# EAGLE board melzi (EAGLE 6.2)
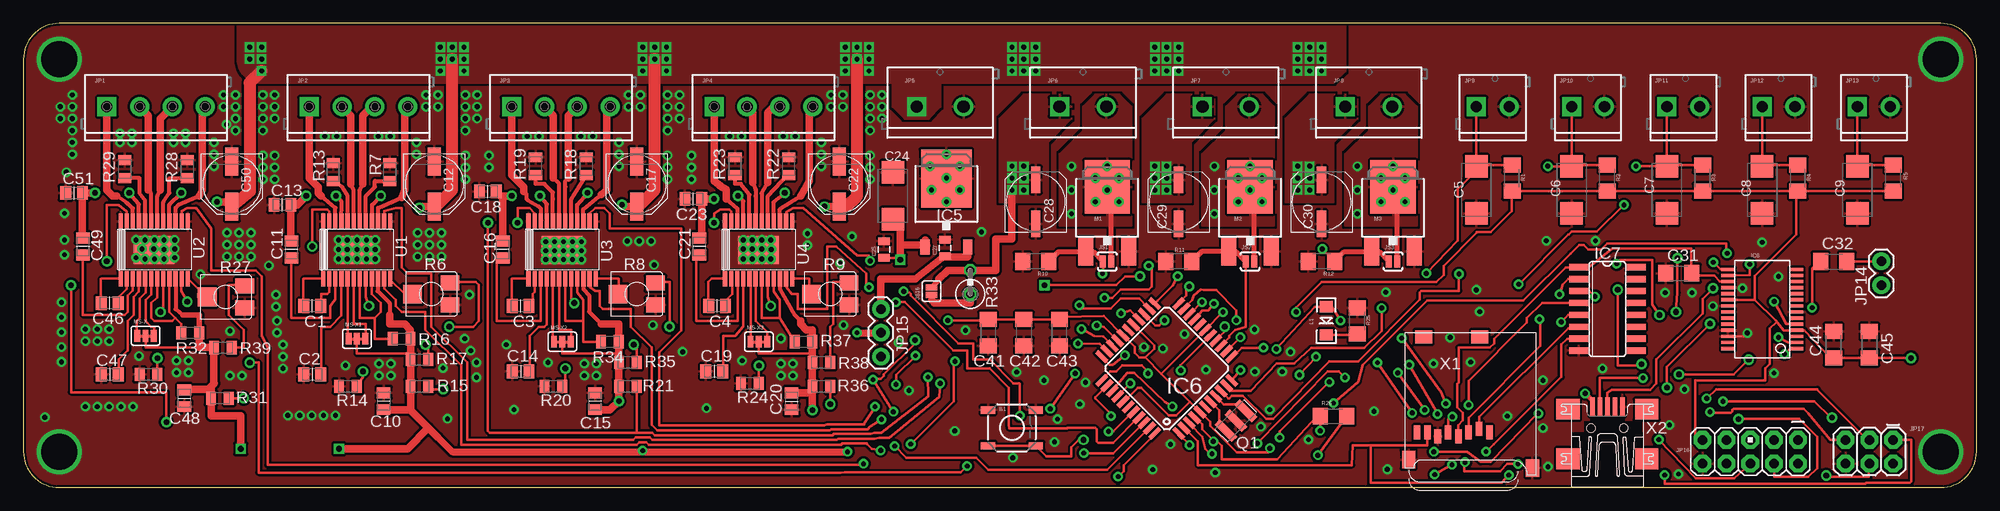
[diagram p2: board, top side]
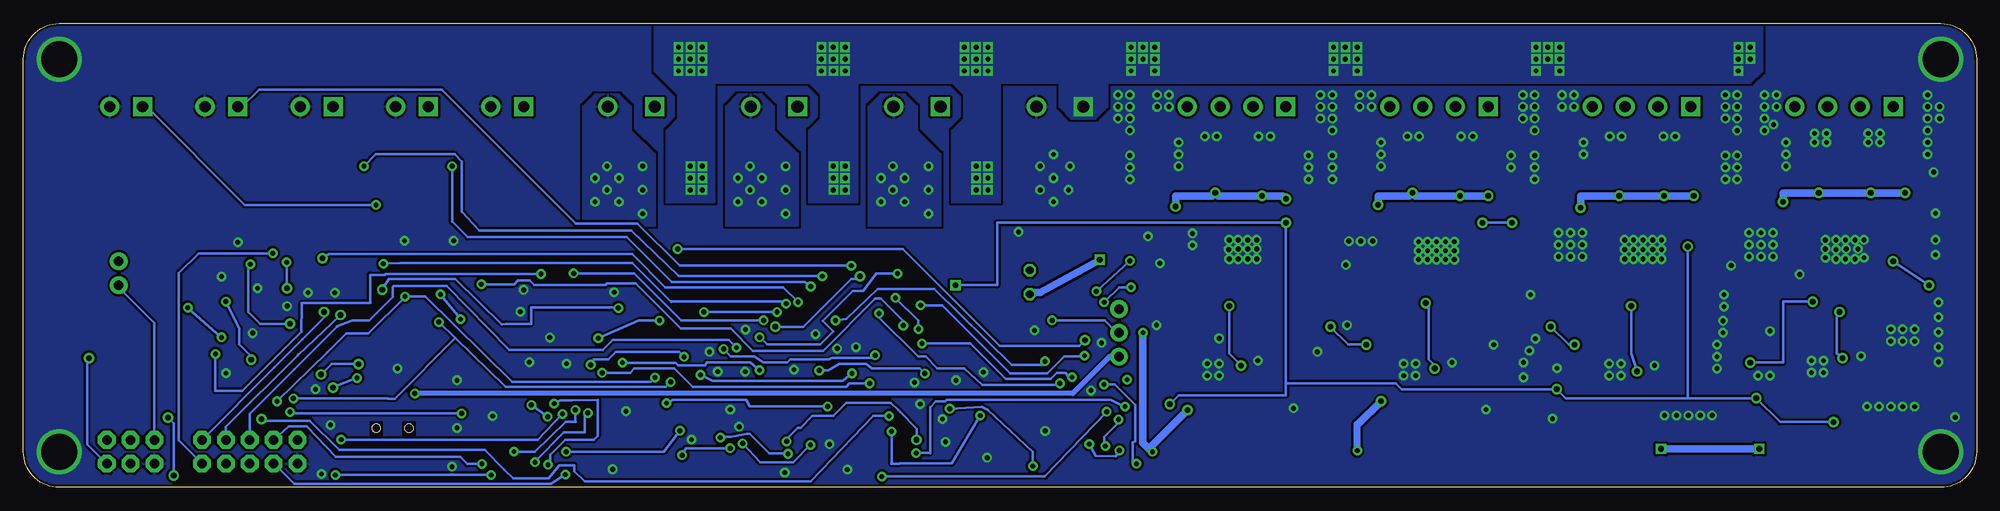
[diagram p3: board, bottom side, seen from below]

Size 208.28 x 49.53 mm. Coordinates in mm from the lower left corner, seen from the top.
Outline: 3.81,49.53 arc90 0,45.72 0,3.81 arc90 3.81,0 204.47,0 arc90 208.28,3.81 208.28,45.72 arc90 204.47,49.53 3.81,49.53
Copper layers (1*16): Top 0.035mm / dielectric 1.5mm / Bottom 0.035mm
Design rules: minimum track width 10mil, minimum drill 20mil, track to track 10mil, track to pad 10mil, pad to pad 10mil, via to via 10mil, smd to smd 0mil, copper to edge 10mil, drill to drill 10mil, minimum pad ring 10mil, minimum via ring 10mil, stop-mask expansion 2mil, vias tented up to drill 25mil, thermal gap 10mil
tRestrict: area 171.2,5.6 to 172.6,7.1; area 170,5.6 to 171.4,7.1; area 166.4,5.6 to 167.9,7.1
bRestrict: area 166.4,5.6 to 167.9,7.1; area 170,5.6 to 171.4,7.1

## Footprints (pad centres in the part's own frame; a part is rotated, then mirrored left to right if it is on the bottom)
TACTILE_SWITCH_SMD = smd 1.524 x 0.762: 1 -2.54,1.905; 2 2.54,1.905; 3 -2.54,-1.905; 4 2.54,-1.905
CAPC2012X145AN = smd 1.15 x 1.45: 1 -0.9,0; 2 0.9,0
SMC_C = smd 2.4 x 2.4: + -2.5,0; - 2.5,0
PANASONIC_D = smd 3 x 1.4: + 2.4,0; - -2.4,0
0805 = smd 0.8 x 1.2: 1 -0.9,0; 2 0.9,0
UD-6,3X7,7_NICHICON = smd 2.8 x 1: + 2.35,0; - -2.35,0
C1206 = smd 1.6 x 1.8: 1 -1.4,0; 2 1.4,0
TO252 = smd 1 x 1.6: 1 -2.28,-4.8; 2 2.28,-4.8 | smd 5.4 x 6.2: 3 0,2.5
TQFP44 = smd 1.5 x 0.5: 1 -5.8,4; 2 -5.8,3.2; 3 -5.8,2.4; 4 -5.8,1.6; 5 -5.8,0.8; 6 -5.8,0; 7 -5.8,-0.8; 8 -5.8,-1.6; 9 -5.8,-2.4; 10 -5.8,-3.2; 11 -5.8,-4; 23 5.8,-4; 24 5.8,-3.2; 25 5.8,-2.4; 26 5.8,-1.6; 27 5.8,-0.8; 28 5.8,0; 29 5.8,0.8; 30 5.8,1.6; 31 5.8,2.4; 32 5.8,3.2; 33 5.8,4 | smd 0.5 x 1.5: 12 -4,-5.8; 13 -3.2,-5.8; 14 -2.4,-5.8; 15 -1.6,-5.8; 16 -0.8,-5.8; 17 0,-5.8; 18 0.8,-5.8; 19 1.6,-5.8; 20 2.4,-5.8; 21 3.2,-5.8; 22 4,-5.8; 34 4,5.8; 35 3.2,5.8; 36 2.4,5.8; 37 1.6,5.8; 38 0.8,5.8; 39 0,5.8; 40 -0.8,5.8; 41 -1.6,5.8; 42 -2.4,5.8; 43 -3.2,5.8; 44 -4,5.8
SO16 = smd 0.66 x 2.032: 1 -4.445,-3.073; 2 -3.175,-3.073; 3 -1.905,-3.073; 4 -0.635,-3.073; 5 0.635,-3.073; 6 1.905,-3.073; 7 3.175,-3.073; 8 4.445,-3.073; 9 4.445,3.073; 10 3.175,3.073; 11 1.905,3.073; 12 0.635,3.073; 13 -0.635,3.073; 14 -1.905,3.073; 15 -3.175,3.073; 16 -4.445,3.073
SSOP28DB = smd 0.348 x 1.397: 1 -4.225,-3.656; 2 -3.575,-3.656; 3 -2.925,-3.656; 4 -2.275,-3.656; 5 -1.625,-3.656; 6 -0.975,-3.656; 7 -0.325,-3.656; 8 0.325,-3.656; 9 0.975,-3.656; 10 1.625,-3.656; 11 2.275,-3.656; 12 2.925,-3.656; 13 3.575,-3.656; 14 4.225,-3.656; 15 4.225,3.656; 16 3.575,3.656; 17 2.925,3.656; 18 2.275,3.656; 19 1.625,3.656; 20 0.975,3.656; 21 0.325,3.656; 22 -0.325,3.656; 23 -0.975,3.656; 24 -1.625,3.656; 25 -2.275,3.656; 26 -2.925,3.656; 27 -3.575,3.656; 28 -4.225,3.656
SCREWTERMINAL-3.5MM-4 = drill 1.2 pad 2.032 square: 1 0,0 | drill 1.2 pad 2.032: 2 3.5,0; 3 7,0; 4 10.5,0
SCREWTERMINAL-5MM-2 = drill 1.3 pad 2.032 square: 1 0,0 | drill 1.3 pad 2.032: 2 5,0
SCREWTERMINAL-3.5MM-2 = drill 1.2 pad 2.032 square: 1 0,0 | drill 1.2 pad 2.032: 2 3.5,0
1X02 = drill 1.016 pad 1.88: 1 0,0; 2 2.54,0
1X03 = drill 1.016 pad 1.88: 1 0,0; 2 2.54,0; 3 5.08,0
AVR_ICSP = drill 1.016 pad 1.88 octagon: 1 -1.27,5.08; 2 1.27,5.08; 3 -1.27,2.54; 4 1.27,2.54; 5 -1.27,0; 6 1.27,0; 7 -1.27,-2.54; 8 1.27,-2.54; 9 -1.27,-5.08; 10 1.27,-5.08
2X3 = drill 1.016 pad 1.88 octagon: 1 0,0; 2 0,2.54; 3 2.54,0; 4 2.54,2.54; 5 5.08,0; 6 5.08,2.54
SJ_2S-NO = smd 0.635 x 1.27: 1 -0.45,0; 2 0.45,0
SJ_2S = smd 0.635 x 1.27: 1 -0.412,0; 2 0.412,0
LED-1206 = smd 1.2 x 1.4: A -1.5,0; C 1.5,0
DPAK = smd 1.6 x 3: 1 -2.28,-5.31; 3 2.28,-5.31 | smd 4.826 x 5.715: 4 0,1.588
SJ_3_CONNECTED = smd 0.635 x 1.27: 1 -0.889,0; 2 0,0; 3 0.889,0
CSTCR6M = smd 0.8 x 2.6: 1 -1.5,0; 2 0,0; 3 1.5,0
1206 = smd 1.6 x 1.8: 1 -1.4,0; 2 1.4,0
RTRIM-ST4ETB = smd 1.6 x 2: 1 -1.175,-2; 2 1.175,-2 | smd 2 x 2: W 0,2
RESC2012X70N = smd 1.05 x 1.4: 1 -0.95,0; 2 0.95,0
0309V = drill 0.813 octagon: 1 -1.27,0; 2 1.27,0
TSSOP-24 = smd 0.45 x 1.65: 1 -3.6,-3.1; 2 -2.95,-3.1; 3 -2.3,-3.1; 4 -1.65,-3.1; 5 -1,-3.1; 6 -0.35,-3.1; 7 0.3,-3.1; 8 0.95,-3.1; 9 1.6,-3.1; 10 2.25,-3.1; 11 2.9,-3.1; 12 3.55,-3.1; 13 3.55,3; 14 2.9,3; 15 2.25,3; 16 1.6,3; 17 0.95,3; 18 0.3,3; 19 -0.35,3; 20 -1,3; 21 -1.65,3; 22 -2.3,3; 23 -2.95,3; 24 -3.6,3 | smd 4.32 x 3: PAD -0.025,-0.05
MICROSD = smd 0.7 x 1.5: 1 9,-10.64; 2 7.9,-10.24; 3 6.8,-10.64; 4 5.7,-11.04; 5 4.6,-10.64; 6 3.5,-11.04; 7 2.4,-10.64; 8 1.3,-10.64 | smd 1.8 x 1.4: CD1 2,-0.44; CD2 8,-0.44 | smd 1.4 x 1.9: MT1 0.4,-13.54; MT2 13.6,-14.44
UX60-MB-5ST = smd 2 x 0.5: 1 2.25,1.6; 2 2.25,0.8; 3 2.25,0; 4 2.25,-0.8; 5 2.25,-1.6 | smd 2.2 x 2.5: M1 -3.3,-4.2; M2 -3.3,4.2; M3 2,4.2; M4 2,-4.2 | hole 0.9: 0,-1.75; 0,1.75

## Placement (x,y rotation side)
B1  RESET  [TACTILE_SWITCH_SMD]  105.41,6.35 0 top
C1  0.1uF  [CAPC2012X145AN]  30.8,19.37 180 top
C2  0.22uF  [CAPC2012X145AN]  30.8,12.06 0 top
C3  0.1uF  [CAPC2012X145AN]  53.02,19.37 180 top
C4  0.1uF  [CAPC2012X145AN]  73.98,19.37 180 top
C5  4.7 uF  [SMC_C]  154.94,31.75 270 top
C6  4.7 uF  [SMC_C]  165.1,31.75 270 top
C7  4.7 uF  [SMC_C]  175.26,31.75 270 top
C8  4.7 uF  [SMC_C]  185.42,31.75 270 top
C9  4.7 uF  [SMC_C]  195.58,31.75 270 top
C10  10uF  [CAPC2012X145AN]  38.42,9.21 270 top
C11  0.1uF  [CAPC2012X145AN]  28.57,25.4 270 top
C12  100uF  [PANASONIC_D]  43.81,32.38 270 top
C13  0.1uF  [CAPC2012X145AN]  27.62,30.16 180 top
C14  0.22uF  [CAPC2012X145AN]  53.02,12.38 0 top
C15  10uF  [CAPC2012X145AN]  60.96,9.21 270 top
C16  0.1uF  [CAPC2012X145AN]  51.12,25.4 270 top
C17  100uF  [PANASONIC_D]  65.41,32.38 270 top
C18  0.1uF  [CAPC2012X145AN]  49.53,31.59 180 top
C19  0.22uF  [CAPC2012X145AN]  73.66,12.38 0 top
C20  10uF  [CAPC2012X145AN]  81.92,9.21 90 top
C21  0.1uF  [CAPC2012X145AN]  72.07,25.72 270 top
C22  100uF  [PANASONIC_D]  87,32.38 270 top
C23  0.1uF  [CAPC2012X145AN]  71.44,30.8 180 top
C24  4.7 uF 30V  [SMC_C]  92.71,31.11 90 top
C25  .33uf  [0805]  91.76,25.4 90 top
C27  .1uf  [0805]  98.27,25.56 90 top
C28  100 uF  [UD-6,3X7,7_NICHICON]  107.95,30.48 90 top
C29  100 uF  [UD-6,3X7,7_NICHICON]  123.19,30.48 90 top
C30  100 uF  [UD-6,3X7,7_NICHICON]  138.43,30.48 90 top
C31  0.1 uF  [C1206]  176.53,22.86 0 top
C32  0.1 uF  [C1206]  193.04,24.13 0 top
C41  1 uF  [C1206]  102.87,16.51 270 top
C42  1 uF  [C1206]  106.68,16.51 270 top
C43  0.1 uF  [C1206]  110.49,16.51 90 top
C44  0.1 uF  [C1206]  193.04,15.24 90 top
C45  0.33 uF  [C1206]  196.85,15.24 270 top
C46  0.1uF  [CAPC2012X145AN]  9.21,19.68 180 top
C47  0.22uF  [CAPC2012X145AN]  9.21,12.06 0 top
C48  10uF  [CAPC2012X145AN]  17.14,9.53 90 top
C49  0.1uF  [CAPC2012X145AN]  6.35,25.72 270 top
C50  100uF  [PANASONIC_D]  22.23,32.38 270 top
C51  0.1uF  [CAPC2012X145AN]  5.4,31.43 180 top
IC5  7805DT  [TO252]  98.42,30.48 0 top
IC6  ATMEGA1284P  [TQFP44]  121.92,12.7 135 top
IC7  4050D  [SO16]  168.91,19.05 270 top
IC8  FT232RL-BASICSSOP  [SSOP28DB]  185.42,19.05 90 top
JP1  X-MOT  [SCREWTERMINAL-3.5MM-4]  8.89,40.64 0 top
JP2  Y-MOT  [SCREWTERMINAL-3.5MM-4]  30.48,40.64 0 top
JP3  Z-MOT  [SCREWTERMINAL-3.5MM-4]  52.07,40.64 0 top
JP4  E-MOT  [SCREWTERMINAL-3.5MM-4]  73.66,40.64 0 top
JP5  PWR  [SCREWTERMINAL-5MM-2]  95.25,40.64 0 top
JP6  BED  [SCREWTERMINAL-5MM-2]  110.49,40.64 0 top
JP7  END  [SCREWTERMINAL-5MM-2]  125.73,40.64 0 top
JP8  FAN  [SCREWTERMINAL-5MM-2]  140.97,40.64 0 top
JP9  X-STOP  [SCREWTERMINAL-3.5MM-2]  154.94,40.64 0 top
JP10  Y-STOP  [SCREWTERMINAL-3.5MM-2]  165.1,40.64 0 top
JP11  Z-STOP  [SCREWTERMINAL-3.5MM-2]  175.26,40.64 0 top
JP12  BEDTEMP  [SCREWTERMINAL-3.5MM-2]  185.42,40.64 0 top
JP13  ENDTEMP  [SCREWTERMINAL-3.5MM-2]  195.58,40.64 0 top
JP14  AUTO-RST  [1X02]  198.12,21.59 90 top
JP15  VREG/USB  [1X03]  91.44,13.97 90 top
JP16  M05X2PTH  [AVR_ICSP]  184.15,3.81 270 top
JP17  AVR_SPI_PRG_6PTH  [2X3]  199.39,5.08 180 top
JS1  HOTBED_BYPASS  [SJ_2S-NO]  115.57,24.13 0 top
JS2  HOTEND_BYPASS  [SJ_2S-NO]  130.81,24.13 0 top
JS3  FAN_BYPASS  [SJ_2S-NO]  146.05,24.13 0 top
JS16  MS3  [SJ_2S]  96.84,20.95 90 top
L1  DEBUG  [LED-1206]  138.94,17.78 270 top
M1  RFP30N06LE  [DPAK]  115.57,30.48 0 top
M2  RFP30N06LE  [DPAK]  130.81,30.48 0 top
M3  RFP30N06LE  [DPAK]  146.05,30.48 0 top
MS-X  [SJ_3_CONNECTED]  13.02,16.19 0 top
MS-X1  [SJ_3_CONNECTED]  35.56,15.88 0 top
MS-X2  [SJ_3_CONNECTED]  57.47,15.56 0 top
MS-X3  [SJ_3_CONNECTED]  78.42,15.56 0 top
Q1  16MHZ  [CSTCR6M]  129.29,7.11 45 top
R1  10k  [1206]  158.75,33.02 90 top
R2  10k  [1206]  168.91,33.02 90 top
R3  10k  [1206]  179.07,33.02 90 top
R4  4k7  [1206]  189.23,33.02 90 top
R5  4k7  [1206]  199.39,33.02 90 top
R6  10k  [RTRIM-ST4ETB]  43.5,20.64 90 top
R7  0.11  [RESC2012X70N]  39.05,33.66 90 top
R8  10k  [RTRIM-ST4ETB]  65.41,20.64 90 top
R9  10k  [RTRIM-ST4ETB]  86.04,20.64 90 top
R10  10k  [1206]  107.95,24.13 180 top
R11  10k  [1206]  123.19,24.13 180 top
R12  10k  [1206]  138.43,24.13 180 top
R13  0.11  [RESC2012X70N]  33.02,33.66 90 top
R14  10k  [RESC2012X70N]  34.61,10.79 180 top
R15  100k  [RESC2012X70N]  42.23,10.79 0 top
R16  4k7  [RESC2012X70N]  40.32,15.88 180 top
R17  20k  [RESC2012X70N]  42.23,13.65 180 top
R18  0.11  [RESC2012X70N]  60.01,34.29 90 top
R19  0.11  [RESC2012X70N]  54.61,34.29 90 top
R20  10k  [RESC2012X70N]  56.52,10.79 180 top
R21  100k  [RESC2012X70N]  64.45,10.79 0 top
R22  0.11  [RESC2012X70N]  81.6,34.29 90 top
R23  0.11  [RESC2012X70N]  75.88,34.29 90 top
R24  10k  [RESC2012X70N]  77.47,11.11 180 top
R25  1K  [1206]  142.24,17.78 90 top
R26  1K  [1206]  139.7,7.62 0 top
R27  10k  [RTRIM-ST4ETB]  21.59,20.32 90 top
R28  0.11  [RESC2012X70N]  17.46,33.97 90 top
R29  0.11  [RESC2012X70N]  10.79,33.97 90 top
R30  10k  [RESC2012X70N]  13.34,12.06 180 top
R31  100k  [RESC2012X70N]  20.95,9.53 0 top
R32  4k7  [RESC2012X70N]  17.78,16.51 180 top
R33  200R  [0309V]  100.97,21.91 90 top
R34  4k7  [RESC2012X70N]  62.55,15.56 180 top
R35  20k  [RESC2012X70N]  64.45,13.34 180 top
R36  100k  [RESC2012X70N]  85.09,10.79 0 top
R37  4k7  [RESC2012X70N]  83.19,15.56 180 top
R38  20k  [RESC2012X70N]  85.09,13.34 180 top
R39  20k  [RESC2012X70N]  21.27,14.92 180 top
U1  A4982  [TSSOP-24]  35.56,25.4 0 top
U2  A4982  [TSSOP-24]  13.97,25.4 0 top
U3  A4982  [TSSOP-24]  57.47,25.4 0 top
U4  A4982  [TSSOP-24]  78.42,25.4 0 top
X1  MICROSD  [MICROSD]  147.32,16.51 0 top
X2  MINI-USB-SHIELD-UX60-MB-5ST  [UX60-MB-5ST]  168.91,6.35 90 top

## Tracks (layer width: path | path; a pad name or v marks a point on that pad's centre or on a via)
!FAN  (via drill 0.51, 0.6)
  Top 0.254: v92.76,8.08 v90.6,11.51 90.68,11.59 91.44,11.59 91.76,11.91 91.76,12.06 95.09,15.4 v95.09,15.72 | v138.51,25.45 139.65,24.31 R12.1 | IC6.44 120.62,5.77 120.62,5.69 117.32,2.38 117.32,1.75 v116.74,1.17
  Top 0.508: JS3.1 144.56,25.17 M3.1 140.87,25.17 R12.1
  Bottom 0.254: v116.74,1.17 99.35,1.17 v92.76,8.08 | v138.51,25.45 114.51,25.45 104.19,15.13 95.67,15.13 v95.09,15.72
!HOTBED  (via drill 0.51)
  Top 0.254: v129.76,16.02 128.29,14.55 IC6.13 | v115.08,22.84 115.14,23.09 115.14,23.9 JS1.1
  Top 0.508: JS1.1 114.08,25.17 M1.1 110.39,25.17 R10.1
  Bottom 0.254: v115.08,22.84 117.32,22.84 118.75,20.95 119.86,20.95 123.03,17.78 121.92,16.64 123.32,15.24 128.98,15.24 v129.76,16.02
!HOTEND
  Top 0.254: IC6.14 127.74,15.11 128.59,16.03 128.59,16.19 129.22,16.83 130.33,17.14 130.35,17.73 130.35,23.9 JS2.1
  Top 0.508: JS2.1 129.32,25.17 M2.1 125.63,25.17 R11.1
!RESET  (via drill 0.51, 0.6)
  Top 0.254: B1.3 B1.4 | IC6.4 124.89,7.44 125.22,7.25 125.73,6.74 125.73,6.19 126.89,5.04 v126.89,4.92 127.32,4.92 127.79,4.45 127.79,3.02 129.33,3.02 129.5,3.01 133.68,3.01 137.97,7.62 R26.1 138.28,7.52 v138.28,6.04 | B1.4 108.05,4.52 | JP17.5 192.66,5.08 190.35,7.9 190.35,7.93 189.87,8.41 182.4,8.41 182.25,8.26 182.25,8.1 182.09,7.94 179.98,7.94 v179.86,8.06 | v161.54,7.9 161.49,7.9 156.46,2.71 155.4,2.71 153.99,3.81 150.56,3.81 v150.4,3.81 | v113.03,5.08 112.55,5.08 111.76,4.29 111.76,3.33 109.06,3.33 B1.4
  Bottom 0.254: JP17.5 194.31,17.55 198.12,21.36 JP14.1 | v150.4,3.81 140.02,3.82 v138.28,6.04 | v113.03,5.08 113.03,6.28 114.8,8.04 115.01,8.26 115.8,9.04 120.52,9.04 121.94,7.62 124.14,7.62 125.41,6.35 125.73,6.35 126.89,5.19 v126.89,4.92 | v161.54,7.9 179.7,7.9 v179.86,8.06
!XYEENABLE  (via drill 0.6)
  Top 0.254: U2.23 11.02,29.43 10.16,30.16 8.89,30.16 v8.89,24.13 | v5.08,21.59 5.08,10.16 15.24,10.16 v15.24,6.99 | v23.5,9.53 R31.2 | U1.23 32.61,29.46 32.38,29.69 30.8,29.69 v30.8,25.72 | v44.77,10.48 43.49,10.48 R15.2 | U4.23 75.47,29.46 75.25,29.69 74.3,29.69 73.66,29.21 v73.66,28.26 | v86.04,8.89 R36.2 | IC6.15 127.15,15.71 128.27,16.83 v128.11,17.14 | v119.06,22.54 117.47,22.54 116.52,21.59 v108.9,21.59
  Bottom 0.254: v8.89,24.13 v5.08,21.59 | v15.24,6.99 20.95,6.99 v23.5,9.53 30.8,9.53 | 30.8,9.53 43.81,9.53 v44.77,10.48 61.28,10.48 61.91,11.11 73.66,11.11 | v30.8,25.72 30.8,9.53 | 73.66,11.11 v73.66,28.26 104.46,28.26 104.46,21.59 v108.9,21.59 | 73.66,11.11 73.66,9.84 85.09,9.84 v86.04,8.89 | v128.11,17.14 125.09,17.14 120.02,22.23 119.38,22.23 v119.06,22.54
!ZENABLE  (via drill 0.51, 0.6)
  Top 0.254: v112.46,15.37 114.77,15.32 115.58,14.51 115.55,14.55 IC6.32 | v96.45,11.79 96.48,9.72 91.46,5.82 90.73,5.82 90.33,5.71 86.42,5.71 86.3,5.59 67.31,5.59 67.06,5.84 65.41,5.84 | 65.41,5.84 49.72,5.84 49.53,6.03 v49.53,28.26 | v52.7,28.26 52.7,29.84 53.98,29.84 54.53,29.23 54.61,28.49 U3.23 | R21.2 65.4,5.84 65.41,5.84
  Bottom 0.254: v112.46,15.37 107.29,15.37 103.51,11.59 98.74,11.59 98.11,12.22 97.16,12.22 96.88,11.79 v96.45,11.79 | v49.53,28.26 v52.7,28.26
AIFO  (via drill 0.51)
  Top 0.254: v187.81,14.25 188.37,14.81 189.05,14.81 IC8.1 | 127.71,10.29 IC6.9 128.24,9.78 128.49,9.53 128.59,9.53 128.84,9.78 130.05,9.78 132.52,7.3 133.25,7.3 139.27,13.47 142.34,13.47 148.91,20.04 148.91,20.8 149.07,20.95 153.03,20.95 153.08,21 v153.08,22.78
  Bottom 0.254: v153.08,22.78 169.66,22.78 169.74,22.7 171.29,22.7 171.31,22.68 171.31,19.7 174.68,19.7 174.69,19.68 178.59,19.68 178.59,19.21 178.64,16.78 178.64,16.62 184.94,10.32 187.8,10.32 v187.8,14.24 v187.81,14.25
AOFI  (via drill 0.51, 0.6)
  Top 0.254: v186.69,19.84 188,17.45 189.05,17.45 IC8.5 | v144.84,19.15 144.84,16.71 143.01,14.88 137.31,14.88 135.51,13.24 133.66,13.24 130.86,10.29 128.88,10.29 128.29,10.87 IC6.10 | v170.02,21.11 170.02,13.02 172.4,13.02 v172.56,13.18 | v176.53,12.06 182.4,12.06 v183.99,13.65
  Bottom 0.254: v144.84,19.15 145.41,19.21 154.15,19.21 154.15,17.46 156.84,17.46 157.25,17.41 162.24,22.24 169.3,22.24 v170.02,21.11 | v172.56,13.18 175.42,13.18 v176.53,12.06 | v183.99,13.65 183.99,13.97 185.26,15.24 185.26,16.98 v186.69,19.84
BEDTEMP  (via drill 0.51)
  Top 0.254: JP12.1 C8.+ 185.42,34.42 R4.2 | v112.84,16.91 114.21,16.19 115.18,16.14 116.1,15.11 IC6.31 | v120,23.67 120.33,23.34 120.33,21.43 120.02,21.11 117,21.11 116.12,20.23 v115.29,20.23
  Bottom 0.254: v120,23.67 138.32,23.67 142.84,28.19 149.4,28.19 163.68,42.47 183.16,42.47 184.99,40.64 JP12.1 | v115.29,20.23 112.87,17.81 112.87,17.62 112.84,17.59 v112.84,16.91
DTR  (via drill 0.51)
  Top 0.254: v187.17,16.02 188.19,15.49 189.05,15.49 IC8.2 | v190.75,19.18 190.75,23.39 C32.1
  Bottom 0.254: v187.17,16.02 v190.75,19.18
E-DIR  (via drill 0.51)
  Top 0.254: IC6.40 118.36,8.03 118.26,8.03 116.21,5.97 v115.71,5.97 | U4.14 81.32,29.41 82.07,29.84 83.19,29.84 88.9,24.77 90.17,24.77 90.17,24.31 v90.3,24.18 | v106.25,7.67 106.25,11.07 106.2,11.11 105.57,11.11 103.03,13.65 101.28,13.65 101.28,15.4 99.69,15.4 94.61,20.48 94.61,20.64 94.46,20.8 94,20.8 v93.87,20.93
  Bottom 0.254: v106.25,7.67 109.29,2.56 114.84,2.56 114.86,2.54 115.73,2.54 115.71,2.56 v115.71,5.97 | v90.3,24.18 v93.87,20.93
E-STEP  (via drill 0.51)
  Top 0.254: v93.03,19.77 93.98,19.77 99.15,14.61 100.65,14.61 100.65,12.7 103.03,12.7 105.09,10.64 105.09,6.67 105.11,6.33 111.3,6.33 111.32,6.35 114.3,6.35 114.46,6.19 114.46,4.92 114.62,4.76 116.2,4.76 118.91,7.46 118.97,7.46 118.95,7.44 IC6.41 | U4.11 81.32,21.39 81.92,20.64 82.55,20.64 82.55,19.05 85.72,19.05 85.72,25.72 86.68,25.72 89.85,22.86 89.85,21.68 v90.17,21.36
  Bottom 0.254: v93.03,19.77 91.44,21.36 v90.17,21.36
ENDTEMP  (via drill 0.51)
  Top 0.254: JP13.1 C9.+ 195.58,34.42 R5.2 | v114.46,17.28 115.21,17.12 116.66,15.67 IC6.30 | v170.68,30.15 170.64,30.15 167.8,27.3 165.1,27.3 164.78,26.99 164.76,26.99 v159.46,21.68
  Bottom 0.254: v170.68,30.15 184.66,30.15 195.15,40.64 JP13.1 | v159.46,21.68 155.96,21.68 155.57,22.07 154.31,22.07 153.83,21.59 146.21,21.59 146.05,21.75 142.96,21.75 138.16,16.95 132.84,16.95 130.49,14.6 123.01,14.6 117.49,20.12 117.46,20.16 116.84,20.16 114.46,17.78 v114.46,17.28
EXT-A1  (via drill 0.51)
  Top 0.254: v122.51,8.64 121.71,9.12 118.46,12.21 117.71,12.21 116.13,10.31 IC6.36 | v139.7,9 142.37,11.28 142.84,13.1 149.68,19.94 159.94,19.94 165,24.99 165.01,24.99 165.89,25.88 166.37,25.88 166.85,25.4 168.28,25.4 168.91,26.04 181.61,26.04 181.61,25.07 v181.69,24.99
  Bottom 0.254: v122.51,8.64 130.84,8.64 131.22,9.34 139.04,9.34 v139.7,9 | v181.69,24.99 189.59,24.99 191.69,22.89 191.69,5 JP16.2
EXT-A2  (via drill 0.51, 0.6)
  Top 0.254: IC6.35 115.55,10.85 115.55,10.87 114.3,9.62 114.3,9.53 115.97,7.86 v115.97,7.62 | v182.88,7.3 189.39,7.3 191.29,5.4 191.29,2.06 190.34,1.11 186.69,1.11 JP16.4
  Bottom 0.254: v115.97,7.62 117.67,7.62 124.34,0.64 148.43,0.64 149.54,1.75 149.54,2.38 151.13,2.38 152.24,0.95 156.05,0.95 157,1.91 157.02,1.91 159.11,4 174.62,4 177.73,7.11 182.69,7.11 v182.88,7.3
EXT-A3  (via drill 0.51)
  Top 0.254: v119.93,12.17 119.79,12.48 119.25,13.02 117.16,13.02 116.52,12.38 115.89,12.38 115.01,11.51 115.01,11.43 IC6.34 | v136.07,12.01 v137.84,13.94 | v147.78,13.09 v150.8,7.85 | v174.4,5.11 174.55,4.95 174.38,5.09 178.33,0.97 182.42,0.97 JP16.6
  Bottom 0.254: v150.8,7.85 153.41,5.08 174.37,5.08 v174.4,5.11 | v136.07,12.01 134.79,11.37 120.9,11.37 v119.93,12.17 | v147.78,13.09 147.78,13.35 147.48,13.65 145.89,13.65 145.1,14.45 138.35,14.45 v137.84,13.94
EXT-A4  (via drill 0.51)
  Top 0.254: v133.61,14.77 137.72,19.28 L1.A 139.04,19.2 139.55,19.2 v140.46,17.81 | v117.45,14.1 116.15,13.08 115.82,13.08 115.01,13.89 115.01,13.97 IC6.33 | v152.34,2.42 v150.49,1.39 | v151.68,8.96 151.21,10.13 v146.98,15.95
  Bottom 0.254: JP16.8 181.53,2.54 179.38,0.38 152.02,0.38 v150.49,1.39 | v151.68,8.96 151.05,9.27 149.84,9.27 147.04,9.37 147.04,5.51 147.48,5.08 150.5,5.08 152.08,3.49 152.08,2.68 v152.34,2.42 | v146.98,15.95 146.93,15.95 142.68,17.81 v140.46,17.81 | v133.61,14.77 133.61,14.71 132.87,13.97 130.33,13.97 129.38,13.34 126.84,13.34 126.52,13.65 122.4,13.65 122.08,13.81 117.58,13.81 v117.45,14.1
EXT-RX1  (via drill 0.51)
  Top 0.254: v129.78,12.52 IC6.11 | v144.39,13.31 144.48,13.2 v148.1,7.95 | v159.38,2.52 158.25,2.52 157.48,1.75 153.67,1.75 153.67,2.64 v153.72,2.69
  Bottom 0.254: v159.38,2.52 160.96,2.52 161.72,3.28 174.96,3.28 178.07,6.55 179.98,6.55 JP16.7 | v144.39,13.31 138.72,13.31 138.43,13.02 135.57,13.02 135.41,13.34 130.76,13.34 v129.78,12.52 | v153.72,2.69 153.72,2.81 150.65,5.87 148.43,5.87 148.44,7.94 v148.1,7.95
EXT-SCL  (via drill 0.51, 0.6)
  Top 0.254: 125.32,18.4 124.89,17.96 IC6.19 125.73,18.89 126.36,18.89 v126.94,19.6 | v169.91,23.89 170.31,24.29 173.67,24.29 173.67,19.53 v174.47,18.41
  Bottom 0.254: v169.91,23.89 168.1,23.95 143.34,23.95 139.2,19.81 139.17,19.84 127.48,19.84 127.23,19.6 v126.94,19.6 | 178.97,14.17 179.04,14.1 | 179.04,14.1 186.69,6.45 JP16.3 | v174.47,18.41 179.04,14.1
EXT-SDA  (via drill 0.51, 0.6)
  Top 0.254: v125.68,19.79 124.41,18.52 124.33,18.52 IC6.20 | v176.21,18.73 176.37,20.8 v176.37,24.45
  Bottom 0.254: v125.68,19.79 127.25,21.36 139.82,21.36 143.38,24.92 175.74,24.92 v176.37,24.45 | JP16.1 181.51,12.8 178.57,15.78 175.91,18.43 175.91,18.55 v176.21,18.73
EXT-TX1  (via drill 0.51)
  Top 0.254: v132.23,14.91 129.95,14.91 129.03,13.99 128.85,13.99 IC6.12
  Bottom 0.254: v132.23,14.91 133.07,15.75 145.43,15.75 146.49,14.68 156.46,14.68 163.14,21.51 168.81,21.51 168.91,21.41 168.91,20.32 171.38,17.85 173.22,17.85 174.85,17.17 174.85,17.11 179.39,12.58 184.15,7.87 JP16.5
GND  (via drill 0.51 pad 1.02, 3.81 pad 1.02)
  Top 0.254: IC8.26 183.83,16.12 v183.83,16.48
  other vias: 13.97,26.42 12.95,26.42 14.99,26.42 12.95,24.38 14.99,24.38 13.97,24.38 14.99,25.4 35.56,26.42 34.54,26.42 36.58,26.42 34.54,24.38 36.58,24.38 35.56,24.38 34.54,25.4 35.56,25.4 36.58,25.4 78.74,26.42 77.72,26.42 77.72,24.38 78.74,24.38 79.76,25.4 20.32,35.56 20.32,36.83 41.91,35.56 41.91,36.83 63.5,35.56 63.5,36.83 85.09,35.56 85.09,36.83 98.42,33.02 96.68,34.29 99.85,34.29 96.84,31.75 99.85,31.75 98.42,30.48 98.42,35.56 44.2,40.64 44.2,41.91 65.79,40.64 65.79,41.91 87.38,40.64 87.38,41.91 22.61,41.91 22.61,40.64 3.81,45.72 3.81,3.81 2.29,7.49 27.05,16.51 27.69,15.24 27.69,13.97 27.69,12.7 27.05,17.78 47.69,14.61 48.32,13.34 48.32,11.75 47.05,15.88 25.53,41.91 25.53,40.64 90.3,41.91 90.3,40.64 68.71,41.91 68.71,40.64 47.12,41.91 47.12,40.64 48.39,41.91 48.39,40.64 69.98,41.91 69.98,40.64 26.8,41.91 26.8,40.64 91.57,41.91 91.57,40.64 68.71,39.37 90.3,39.37 47.12,39.37 25.53,39.37 25.53,38.1 26.8,39.37 47.12,38.1 48.39,39.37 68.71,38.1 69.98,39.37 90.3,38.1 91.57,39.37 86.11,41.91 86.11,40.64 64.52,40.64 64.52,41.91 42.93,40.64 42.93,41.91 21.34,40.64 21.34,41.91 3.94,40.64 5.21,41.91 5.21,40.64 3.94,39.37 63.5,34.29 20.32,34.29 85.09,34.29 21.72,25.91 204.47,45.72 204.47,3.81 121.51,14.83 113.25,11.21 100.46,16.76 105.92,12.32 108.84,11.43 99.31,6.03 112.65,8.89 110.27,7.3 109.95,4.86 126.11,12.57 119.51,14.99 123.83,16.38 131.95,6.48 144.02,8.13 135.13,14.48 150.37,13.21 155.29,18.76 145.29,20.83 152.15,16 154.94,21.08 187.17,22.51 180.15,19.37 162.4,26.32 167.64,26.32 134.24,12.35 131.32,12.35 132.91,8.32 21.72,24.64 24.26,24.64 26.16,23.69 22.99,24.64 22.99,25.91 47.56,20.57 26.92,20.57 26.92,19.3 26.8,35.43 26.8,34.16 26.8,32.89 49.66,35.43 49.66,34.16 71.25,32.89 71.25,34.16 71.25,35.43 68.71,34.16 68.71,35.43 68.71,32.89 90.3,32.89 90.3,34.16 90.3,35.43 47.12,35.43 47.12,34.16 47.12,32.89 25.53,35.43 25.53,34.16 25.53,32.89 32.13,37.47 33.4,37.47 53.72,37.47 54.99,37.47 75.31,37.47 76.58,37.47 37.85,37.47 39.12,37.47 59.44,37.47 60.71,37.47 81.03,37.47 82.3,37.47 177.13,10.48 168.4,12.7 162.05,11.43 158.24,7.62 162.05,6.35 176.5,1.43 175.55,6.67 185.42,26.16 186.69,12.19 162.59,2.21 12,26.42 12,24.51 12.64,25.46 13.91,25.46 16.13,26.42 16.13,26.42 16.13,25.46 16.13,24.51 4.38,26.42 4.38,24.83 4.06,19.75 4.06,18.16 4.06,16.57 4.06,14.99 4.06,13.4 10.29,37.78 11.56,37.78 11.56,36.83 10.29,36.83 16,37.78 17.27,37.78 17.27,36.83 16,36.83 5.21,39.37 5.21,38.1 5.21,36.83 5.21,35.56 24.26,27.18 22.99,27.18 24.26,25.91 21.72,27.18 16.32,13.53 17.59,13.53 17.59,12.26 16.32,12.26 22.03,16.7 22.03,11.94 23.3,11.94 6.6,16.89 7.87,16.89 9.14,16.89 6.6,15.62 7.87,15.62 9.14,15.62 6.6,8.64 7.87,8.64 9.14,8.64 10.41,8.64 11.68,8.64 4.57,33.66 4.38,29.27 22.61,39.37 22.61,38.1 21.65,38.73 33.59,26.42 33.59,25.4 33.59,24.38 37.53,26.42 37.53,25.4 37.53,24.38 12.32,14.03 34.35,13.02 59.5,26.23 59.5,25.27 59.5,24.32 58.55,26.23 58.55,25.27 58.55,24.32 57.59,24.32 57.59,25.27 57.59,26.23 56.64,26.23 56.64,25.27 56.64,24.32 55.69,24.32 55.69,25.27 55.69,26.23 76.77,26.42 77.72,25.46 76.77,25.46 76.77,24.38 78.74,25.46 79.69,26.42 79.69,24.38 55.94,13.34 51.5,15.24 18.86,22.73 28.19,7.68 29.46,7.68 30.73,7.68 32,7.68 33.27,7.68 52.32,8.32 42.04,25.91 42.04,24.64 44.58,24.64 43.31,24.64 43.31,25.91 44.58,27.18 43.31,27.18 44.58,25.91 42.04,27.18 64.4,26.29 65.67,26.29 66.94,26.29 67.26,23.75 80.77,13.21 82.04,13.21 82.04,11.94 80.77,11.94 76.64,13.53 70.29,14.48 72.83,8.45 67.12,17.34 87.44,17.34 59.82,13.21 61.09,13.21 61.09,11.94 59.82,11.94 83.61,27.11 88.37,26.79 83.61,25.84 87.1,23.94 102.18,27.27 37.91,13.21 39.18,13.21 39.18,11.94 37.91,11.94 131.29,16.86 127.1,1.59 122.33,4.6 145.45,1.94 177.93,20.8 175.07,20.8 183.32,21.27 44.74,12.73 45.21,7.33 93.31,15.43 94.42,10.35 80.77,15.91 137.03,5.11 120.43,1.91 105.51,3.17 154.34,13.37
  pour Bottom (rank 6): -3.81,53.34 212.09,53.34 212.09,-3.81 -3.81,-3.81
  pour Top (rank 6): -5.08,54.61 -5.08,-5.08 165.1,-5.08 172.72,-5.08 213.36,-5.08 213.36,54.61
HOTBED-GND  (via drill 0.51 pad 1.02)
  Top 0.254: M1.4 116.02,31.62
  Top 0.508: JS1.2 116.02,29.66 v116.84,30.48
  other vias: 114.3,33.02 114.3,30.48 115.57,34.29 116.84,33.02 111.76,34.29 111.76,31.75 111.76,29.21 115.57,31.75
  pour Top: 118.11,27.94 110.49,27.94 110.49,35.56 113.03,38.1 113.03,40.64 114.3,41.91 116.84,41.91 118.11,40.64
  pour Bottom: 110.49,27.94 118.11,27.94 118.11,40.64 116.84,41.91 114.3,41.91 113.03,40.64 113.03,38.1 110.49,35.56
HOTBED-GND1  (via drill 0.51 pad 1.02)
  Top 0.254: M2.4 131.26,31.62
  Top 0.508: JS2.2 131.26,29.66 v132.08,30.48
  other vias: 130.81,34.29 129.54,33.02 132.08,33.02 129.54,30.48 127,34.29 127,31.75 127,29.21 130.81,31.75
  pour Top: 125.73,27.94 133.35,27.94 133.35,40.64 132.08,41.91 129.54,41.91 128.27,40.64 128.27,38.1 125.73,35.56
  pour Bottom: 125.73,27.94 133.35,27.94 133.35,40.64 132.08,41.91 129.54,41.91 128.27,40.64 128.27,38.1 125.73,35.56
HOTBED-GND2  (via drill 0.51 pad 1.02)
  Top 0.254: M3.4 146.5,31.62
  Top 0.508: JS3.2 146.5,29.66 v147.32,30.48
  other vias: 146.05,34.29 144.78,33.02 147.32,33.02 144.78,30.48 142.24,34.29 142.24,31.75 142.24,29.21 146.05,31.75
  pour Top: 148.59,27.94 140.97,27.94 140.97,35.56 143.51,38.1 143.51,40.64 144.78,41.91 147.32,41.91 148.59,40.64
  pour Bottom: 140.97,27.94 148.59,27.94 148.59,40.64 147.32,41.91 144.78,41.91 143.51,40.64 143.51,38.1 140.97,35.56
MISO  (via drill 0.51)
  Top 0.254: 143.67,4.51 141.73,4.51 141.67,2.38 125.25,2.38 125.25,4.92 123.85,6.33 123.77,6.33 IC6.2 | X1.7 149.71,5.87 149.71,4.51 143.67,4.51 | v175.03,1.33 175.02,0.38 196.42,0.38 196.51,0.48 201.14,0.48 201.29,0.64 201.29,5.08 JP17.1 | v158.41,1.33 157.64,0.48 143.67,0.48 143.67,4.51
  Bottom 0.254: v158.41,1.33 v175.03,1.33
MOSI  (via drill 0.51, 0.6)
  Top 0.254: v124.36,4.55 123.22,5.69 123.22,5.77 IC6.1 | v131.58,4.71 139.08,12.37 140.28,12.37 v140.92,11.73 | v167.58,20.37 166.95,20.95 IC7.3 | JP17.4 196.77,2.54 196.79,1.13 192.39,1.13 v192.25,1.27 | v181.24,9.19 189.12,9.19 189.14,9.21 190.98,9.21 192.72,7.46 v192.88,7.46
  Bottom 0.254: v181.24,9.19 175.86,14.41 173.84,16.43 | 173.84,16.43 171.51,16.43 167.59,20.34 v167.58,20.37 165.42,20.37 156.16,11.29 141.36,11.29 v140.92,11.73 | v124.36,4.55 126.21,2.7 129.73,2.7 v131.58,4.71 | 173.84,16.43 | v192.25,1.27 192.25,6.83 v192.88,7.46
N$1
  Top 0.254: U2.1 8.33,22.3 8.26,22.23 8.26,19.74 C46.2
N$2
  Top 0.254: L1.C 142.16,16.28 142.24,16.36 R25.1
N$3
  Top 0.254: U1.1 29.92,22.3 29.84,22.23 29.84,19.42 C1.2
N$4
  Top 0.254: U2.2 11.02,21.18 10.16,20.32 10.16,19.74 C46.1
N$5
  Top 0.254: U2.17 arc90 U2.17 | R28.1
  Top 0.406: U2.17 14.92,30.48 15.56,31.43 15.56,33.02 R28.1
N$6
  Top 0.254: U2.20 12.99,28.42 | R29.1
  Top 0.406: 12.99,28.42 12.99,30.62 12.38,31.43 12.38,33.02 R29.1
N$7
  Top 0.254: 17.52,21.85 U2.12 18.73,21.09 18.73,20.64 19.27,20.64
  Top 0.406: R27.W 18.73,20.32 18.73,20.64
N$8  (via drill 0.6)
  Top 0.254: U2.8 14.92,18.73 v14.61,18.73 | v14.29,13.81 R30.1
  Bottom 0.254: v14.61,18.73 14.92,18.73 14.92,14.29 v14.29,13.81
N$9
  Top 0.254: C47.2 10.16,12.12 10.16,13.65 11.11,14.61 11.11,17.78 11.75,18.41 11.75,20.32 12.32,20.89 U2.4
N$10
  Top 0.254: U2.9 15.57,18.72 16.19,18.1 | 16.19,18.1 16.83,17.46 R32.2 | U2.7 14.27,20.3 13.65,19.68 13.65,18.1 13.97,17.78 15.88,17.78 16.19,18.1
N$11
  Top 0.254: U1.2 32.61,20.86 32.38,20.64 31.75,20.64 31.75,19.42 C1.1
N$12  (via drill 0.51)
  Top 0.254: v163.82,20.6 164.13,21.64 164.72,22.23 IC7.2 | X1.3 154.13,5.89 154.13,7.44 161.77,15.08 161.77,17.91 v161.66,17.97
  Bottom 0.254: v161.66,17.97 v163.82,20.6
N$13  (via drill 0.51)
  Top 0.254: v152.38,7.54 151.94,7.26 151.94,5.89 X1.5 | v154.11,8.8 154.11,11.38 160.34,17.6 160.34,18.1 161.95,19.71 165.81,19.71 IC7.4
  Bottom 0.254: v152.38,7.54 v154.11,8.8
N$14
  Top 0.254: IC7.6 164.72,16.99 155.25,7.51 155.25,6.27 X1.2
N$15
  Top 0.406: C27.1 98.16,24.66
  Top 0.762: JP15.3 91.44,20.16 91.44,20.32
  Top 0.813: IC5.2 100.7,24.66 100.65,24.61 98.32,24.61 C27.1 | 98.16,24.66 95.09,22.23 91.44,22.23 91.44,20.16
N$16
  Top 0.254: U1.17
  Top 0.406: U1.17 36.51,31.11 37.47,32.07 37.47,32.7 R7.1
N$17
  Top 0.406: U1.20 34.56,31.11 33.97,32.07 R13.1
N$18
  Top 0.254: U1.12 39.11,22.17 40.64,20.64 R6.W 41.59,20.64
N$19  (via drill 0.6)
  Top 0.254: U1.8 36.51,20.32 v36.83,19.37 | v36.2,12.38 36.2,11.75 R14.1
  Bottom 0.254: v36.83,19.37 36.83,14.29 v36.2,12.38
N$20
  Top 0.254: U3.1 52.15,22.3 52.07,22.23 52.07,19.42 C3.2
N$21
  Top 0.254: U3.2 54.52,20.86 54.29,20.64 54.29,19.74 C3.1
N$22
  Top 0.406: U3.17 58.42,30.8 R18.1
N$23
  Top 0.254: U2.3 11.67,21.04 11.11,20.48 11.11,18.73 10.79,18.41 6.35,18.41 C49.2
N$25
  Top 0.254: U4.1 73.42,22.3 73.03,21.91 73.03,19.42 C4.2
N$26
  Top 0.254: C32.2 JP14.2
N$27
  Top 0.254: C4.1 74.88,19.95 75.56,20.64 75.56,22.21 U4.2
N$28
  Top 0.254: IC6.7 127.51,8.24 127.51,6.86 128.22,6.14 Q1.1
N$29
  Top 0.254: 129.54,8.89 129.69,8.89 | 129.54,8.89 130.26,8.17 Q1.3 | IC6.8 127.99,8.89 129.54,8.89
N$30
  Top 0.254: U2.5 13.02,22.3 13.02,20.8 12.38,20.16 12.38,18.1 12.06,17.78 12.06,16.26 MS-X.1
N$31
  Top 0.254: U2.6 13.62,20.61 13.02,20 13.02,17.78 13.65,17.14 13.97,17.14 13.97,16.26 MS-X.3
N$32
  Top 0.406: U2.18 14.29,31.11 14.61,31.75
  Top 0.813: JP1.3 14.61,39.37 14.61,31.75
N$33
  Top 0.406: U2.15 16.24,29.84 16.51,30.16 18.73,31.11
  Top 0.813: JP1.4 19.05,40.3 19.05,31.75 18.73,31.11
N$34
  Top 0.406: U2.19 13.61,31.42 13.34,31.75
  Top 0.813: JP1.2 13.34,39.69 13.34,31.75
N$35
  Top 0.254: U2.22 11.69,28.15
  Top 0.406: 11.69,28.15 11.66,29.77 11.1,30.3 10.91,30.44 9.96,31.08
  Top 0.813: 9.96,31.08 9.53,31.11 8.89,31.75 JP1.1
N$36  (via drill 0.6)
  Top 0.254: C25.1 93.5,24.5 v93.5,24.29
  Top 0.61: 96.84,20 JS16.1
  Top 0.813: 96.84,20 97.16,19.68 100.97,19.68 R33.1 | 96.14,25.93 IC5.1 96.3,25.82 | 92.75,28.57 C24.+ 93.5,27.82 93.5,25.88 | v93.5,24.29 93.5,25.88 | 96.14,26.41 96.14,25.93 | 96.14,25.93 96.2,25.88 93.5,25.88
  Bottom 0.813: v93.5,24.29 99.85,20.8 100.81,20.8 R33.1
N$37
  Top 0.254: U1.4 33.91,18.35 32.7,17.14 31.75,17.14 31.75,12.44 C2.2
N$38
  Top 0.254: U1.7 35.86,18.1 37.47,18.1 | 37.47,18.1 37.47,15.88 R16.2 | U1.9 37.16,20.62 38.1,19.68 38.1,18.73 37.47,18.1
N$39
  Top 0.254: U1.3 33.26,20.08 32.7,19.37 32.7,18.1 28.57,18.1 C11.2
N$40
  Top 0.254: U1.5 34.56,15.99 MS-X1.1
N$41
  Top 0.254: U1.6 35.21,17.5 35.24,17.46 36.51,17.46 36.51,15.94 MS-X1.3
N$42
  Top 0.406: U1.18 35.88,31.75 36.2,32.38
  Top 0.813: JP2.3 37.15,40.64 36.2,39.69 36.2,32.38
N$43
  Top 0.254: 37.81,28.43 U1.15
  Top 0.406: 37.81,28.43 37.81,29.84 40.32,30.96
  Top 0.813: JP2.4 40.96,40.64 40.64,40.32 40.64,31.75 40.32,30.96
N$44
  Top 0.406: U1.19 35.21,31.75 34.92,32.38
  Top 0.813: JP2.2 34.92,39.69 34.92,32.38
N$45
  Top 0.254: 33.27,28.46 U1.22
  Top 0.406: 33.27,28.46 33.27,29.83 31.75,31.11
  Top 0.813: JP2.1 30.48,33.02 31.43,32.07 31.43,31.43 31.75,31.11
N$46  (via drill 0.6)
  Top 0.254: R17.1 43.18,14.93 v42.86,15.24 | v45.4,17.14 47.94,17.14 48.58,17.78 48.58,21.59 48.26,21.91 45.59,21.91 R6.2
  Bottom 0.254: v42.86,15.24 43.5,15.24 v45.4,17.14
N$47
  Top 0.406: U3.20 56.47,30.75 56.47,30.85 56.47,31.48 55.56,32.38 54.61,32.38 R19.1
N$48
  Top 0.254: U3.12 63.42,22.3 63.5,22.23 63.5,20.73 R8.W
N$49  (via drill 0.6)
  Top 0.254: R20.1 57.47,10.16 57.78,10.48 v57.78,12.7 | v58.74,19.68 58.42,20 U3.8
  Bottom 0.254: v57.78,12.7 57.78,13.02 58.42,13.65 58.42,19.37 v58.74,19.68
N$50
  Top 0.254: U3.4 55.82,17.4 55.56,17.14 54.93,17.14 53.98,16.19 53.98,12.44 C14.2
N$51
  Top 0.254: U3.7 57.77,17.8 57.78,17.78 59.69,17.78 | 59.69,17.78 59.69,15.56 R34.2 | U3.9 59.07,20.97 59.07,20.8 59.7,20.01 59.69,17.78
N$52
  Top 0.254: U3.3 55.17,17.86 55.16,17.78 50.48,17.78 50.48,23.86 C16.2
N$53
  Top 0.254: U3.5 56.47,15.67 MS-X2.1
N$54
  Top 0.254: U3.6 57.12,16.86 57.15,16.83 58.42,16.83 58.42,15.62 MS-X2.3
N$55
  Top 0.406: U3.18 57.77,32.05 57.78,32.07 57.78,32.7 58.1,33.02
  Top 0.813: JP3.3 58.1,39.69 58.1,33.02
N$56
  Top 0.406: U3.15 59.69,29.69 61.59,31.27
  Top 0.813: JP3.4 62.55,40.64 62.23,40.32 62.23,31.75 61.59,31.27
N$57
  Top 0.406: U3.19 57.12,32.42 56.52,33.02
  Top 0.813: JP3.2 56.52,39.69 56.52,33.02
N$58
  Top 0.406: U3.22 55.2,28.57 55.2,29.73 54.93,30 53.82,30.64 53.66,30.8 53.66,31.27 53.34,31.59
  Top 0.813: JP3.1 52.07,33.34 53.34,32.07 53.34,31.59
N$59  (via drill 0.6)
  Top 0.254: R35.1 65.4,14.93 v65.09,15.24 | v68.9,17.14 68.9,21.91 67.5,21.91 R8.2
  Bottom 0.254: v65.09,15.24 66.99,15.24 v68.9,17.14
N$60
  Top 0.406: U4.17 79.38,31.11 81.6,33.49 R22.1
N$61
  Top 0.406: U4.20 77.42,28.43 77.42,31.26 76.52,32.38 75.88,32.38 R23.1
N$62
  Top 0.254: U4.12 83.75,22.3 83.82,22.23 83.82,20.86 R9.W
N$63  (via drill 0.6)
  Top 0.254: U4.8 79.37,20.32 v79.69,19.37 | v78.42,13.02 R24.1
  Bottom 0.254: v79.69,19.37 79.69,14.29 v78.42,13.02
N$64
  Top 0.254: U4.4 76.77,17.21 75.88,16.19 74.61,16.19 74.61,12.44 C19.2
N$65
  Top 0.254: U4.7 78.74,22.3 78.74,18.1 80.64,18.1 | 80.64,18.1 R37.2 | U4.9 80.02,20.94 80.64,20 80.64,18.1
N$66
  Top 0.254: U4.3 76.2,22.22 76.2,17.78 71.75,17.78 71.75,24.5 C21.2
N$67
  Top 0.254: MS-X3.1 77.53,22.19 U4.5
N$68
  Top 0.254: MS-X3.3 79.31,16.57 78.11,17.78 78.11,22.27 U4.6
N$69
  Top 0.254: R39.1 23.5,14.92 23.5,16.83 21.91,18.41 21.91,21.59 23.5,21.59 R27.2
N$70
  Top 0.406: 79.38,32.54 78.71,31.4 78.71,28.39 U4.18
  Top 0.813: JP4.3 80.01,40.64 79.38,40.01 79.38,32.54
N$71
  Top 0.406: U4.15 80.68,28.44 80.68,29.7 82.87,31.11
  Top 0.813: JP4.4 84.14,40.64 83.82,40.32 83.82,32.7 82.87,31.11
N$72
  Top 0.406: 77.79,32.54 78.07,31.77 78.07,31.13 78.07,31.08 U4.19
  Top 0.813: JP4.2 77.79,40.01 77.79,32.54
N$73
  Top 0.406: 74.93,30.8 76.12,29.77 U4.22
  Top 0.813: JP4.1 73.66,32.7 74.37,32.15 74.32,32.16 74.93,31.78 74.93,30.8
N$74
  Top 0.254: R38.1 86.04,17.14 86.36,17.46 86.36,21.91 87.95,21.91 R9.2
SCLK  (via drill 0.51)
  Top 0.254: v163.99,17.65 164.72,18.41 IC7.5 | IC6.3 124.33,6.88 124.41,6.88 124.41,6.72 125.73,5.4 126.05,4.13 126.59,3.59 v126.75,3.59 | JP17.3 196.62,5.08 191.29,10.41 191.29,10.48 180.5,10.48 179.52,9.5 v179.5,9.5 | v139.26,11.27 133.96,5.97 v133.96,5.33
  Bottom 0.254: 162.24,15.94 v163.99,17.65 | 162.24,15.94 156.87,10.72 139.79,10.72 v139.26,11.27 | v179.5,9.5 169.42,9.5 169.39,9.47 168.71,9.47 162.24,15.94 | v133.96,5.33 133.9,5.4 132.87,5.4 131.13,5.71 130.81,5.71 128.75,3.65 126.82,3.65 v126.75,3.59
SD-SS  (via drill 0.51)
  Top 0.254: v118.04,11.11 116.69,9.75 IC6.37 | v146.56,12.24 v149.42,8.27 | v155.97,3.82 156.82,4.61 164.01,11.8 164.01,15.24 164.64,15.88 IC7.7
  Bottom 0.254: v118.04,11.11 120.2,11.11 120.56,10.75 136.91,10.75 138.86,12.7 143.13,12.7 143.59,12.24 v146.56,12.24 | v155.97,3.82 153.77,3.82 150.44,6.99 149.38,6.99 149.42,7.02 v149.42,8.27
USBDM  (via drill 0.51, 0.6)
  Top 0.254: v184.09,23.81 184.07,23.74 184.07,22.69 182.4,22.63 181.79,22.63 IC8.16 | v172.71,11.68 168.1,11.68 168.12,10.44 168.12,8.61 X2.2 | v175.26,10.64 175.26,12.86 v179.86,17.46
  Bottom 0.254: v172.71,11.68 175.2,10.73 v175.26,10.64 | v179.86,17.46 183.04,17.46 184.31,18.73 184.31,23.59 v184.09,23.81
USBDP  (via drill 0.51, 0.6)
  Top 0.254: v180.21,24.03 180.94,23.29 181.76,23.29 IC8.15 | X2.3 168.91,8.61 168.88,8.64 168.88,10.08 169.38,10.42 173.46,10.42 174.15,11.11 174.15,13.65 179.07,18.57 179.07,20.11 180.18,21.22 v180.18,21.27
  Bottom 0.254: v180.21,24.03 180.21,21.3 v180.18,21.27
UVCC  (via drill 0.51)
  Top 0.254: 167.34,9.25 167.34,8.61 X2.1
  Top 0.483: v166.55,10.03 167.34,9.25
  Bottom 0.508: v166.55,10.03 96.38,10.03 92.44,13.97 JP15.1
VCC  (via drill 0.51, 0.51 pad 1.02, 0.6)
  Top 0.254: 119.65,13.86 121.36,12.14 | 121.36,12.14 124.38,9.12 | 124.38,9.12 125.45,8.05 IC6.5 125.55,8 126.56,6.99 126.56,6.58 129.38,3.76 132.81,3.76 v132.91,4.18 | IC6.38 117.27,9.17 117.37,9.17 118.84,10.64 119.22,10.64 122.16,7.7 122.95,7.7 124.38,9.12 | 118.39,17.25 118.39,17.35 IC6.27 120.6,15.15 120.6,14.81 119.65,13.86 | 121.36,12.14 IC6.17 126.09,16.89 v127.91,18.72 | v138.03,3.44 R26.2 | v98.58,17.83 102.77,17.83 C41.1 C42.1 106.78,17.91 C43.2 110.43,18.22 115.21,18.29 IC6.29 117.27,16.23 118.49,15.01 118.49,14.35 118.99,13.86 119.65,13.86 | R3.1 179.17,31.62 | R3.1 R4.1 | R5.1 189.33,31.62 R4.1 | 184.63,20.02 181.79,20.02 IC8.20 | 187,17.62 186.84,17.8 184.63,20.02 | 187,17.62 187.73,16.76 188.85,16.76 188.95,16.82 IC8.4 189.08,16.76 189.92,16.76 192.68,13.84 C44.1 193.14,13.84 C45.2 | C45.2 196.29,13.74 | R3.1 169.01,31.62 R2.1 R1.1 158.7,31.5 158.7,29.49 156.46,27.25 155,27.25 155,27.21 151.45,23.65 151.45,22.7 150.65,21.91 138.43,21.91 135.72,19.2 v135.72,18.72 | U2.10 16.24,22.29 | MS-X.2 13.02,14.92 18.73,14.92 | 37.78,22.27 U1.10 | MS-X1.2 35.56,14.29 41.28,14.29 | MS-X2.2 57.47,14.29 63.5,14.29 | MS-X3.2 78.42,14.29 83.82,14.29 84.14,13.97 | JP16.9 178.28,5.4 178.28,11.43 185.74,11.43 185.74,12.7 186.21,13.18 186.21,16.95 186.95,17.68 187,17.63 187,17.62 | 184.63,20.02 184.63,22.55 189.07,26.99 189.07,31.46 R4.1 | v201.29,13.81 196.88,13.81 C45.2
  Top 0.406: U3.10 59.71,21.16 60.33,20.48 60.33,18.73 61.59,17.46 | U4.10 80.67,21.25 82.23,18.41 82.87,17.78 | 37.78,22.27 37.78,20.95 39.05,19.68 39.05,18.41 | 16.24,22.29 16.24,19.04 16.99,18.41
  Top 0.61: 16.99,18.41 18.73,18.41 R32.1
  Top 0.762: 44.2,5.33 45.72,3.81 65.91,3.81 v66.04,3.94 66.17,3.81 v87.88,3.81 | v88.9,16.51 JP15.2
  Top 0.813: R31.1 20,7.62 23.18,7.62 v23.18,4.13 | R31.1 | R31.1 20,10.48 19.68,10.48 | 19.68,10.48 17.2,10.48 C48.2 | 19.68,10.48 20.32,11.12 R39.2 | R32.1 18.73,14.92 R39.2 | R39.2 | 41.28,8.25 R15.1 R17.2 41.28,14.29 R16.1 41.27,16.83 40.64,17.46 39.05,17.46 39.05,18.41 | 41.28,8.25 43.18,6.35 | 43.18,6.35 44.2,5.33 | 61.59,17.46 63.5,17.46 R34.1 | R34.1 | R34.1 63.5,14.29 R35.2 R21.1 v63.5,9.21 62.55,8.26 61.01,8.26 C15.2 | C10.2 41.22,8.31 41.28,8.25 | C20.2 84.08,10.11 | 84.08,10.11 84.14,10.16 R36.1 R38.2 84.14,13.97 R37.1 84.14,16.83 83.5,16.83 82.87,17.46 82.87,17.78 | v84.14,8.26 84.14,10.05 84.08,10.11 | v33.66,4.13 40.96,4.13 43.18,6.35
  Bottom 0.254: v98.58,17.83 92.99,17.83 91.67,16.51 JP15.2 | v127.91,18.72 v135.72,18.72 | v132.91,4.18 137.66,4.18 v138.03,3.44 | JP17.2 201.45,4.6 201.45,13.65 v201.29,13.81
  Bottom 0.762: v66.04,3.94 66.04,6.73 | v88.9,16.51 88.9,4.83 v87.88,3.81
  Bottom 0.813: v33.66,4.13 v23.18,4.13 | 66.04,6.73 65.97,6.73 v63.5,9.21 | v88.9,16.51 88.9,4.76 87.95,3.81 87.95,4.45 v84.14,8.26
VDD
  Top 0.254: IC8.17 181.76,22 180.9,22 180.29,22.61 178.21,22.61 177.95,22.86 C31.2 177.88,22.96 177.86,25.51 169.45,25.51 166.98,23.52 165.94,23.52 IC7.1 164.47,23.5 156.84,15.88 156.84,15.4 156.37,14.92 153.03,14.92 153.03,11.2 152.88,11.04 152.88,8.57 153.51,7.94 153.51,7.14 153.01,6.64 153.01,5.49 X1.4
VMOT  (via drill 0.51 pad 1.02, 0.6)
  Top 0.254: 37.18,28.41 U1.16
  Top 0.406: U2.21 12.32,30.23 v11.29,31.43 | U2.16 15.57,30.18 v16.83,31.43 | U1.21 33.92,30.5 v33.34,31.11 | 37.18,28.41 37.18,30.16 v38.1,31.11 | U3.16 59.07,30.15 59.05,30.16 v60.17,31.43 | U3.21 55.82,30.23 v55.09,31.11 | U4.16 80.02,30.49 v81.18,31.43 | U4.21 76.77,30.54 v76.2,31.11
  Top 0.61: 97.63,22.23 97.63,22.16 JS16.2
  Top 0.813: 21.91,30.48 v20.64,30.48 | v7.62,31.43 C51.1 6.3,26.62 C49.1 | C12.+ 42.37,29.98 v42.23,29.84 | v30.16,31.11 29.21,30.16 C13.1 28.52,26.35 C11.1 | C17.+ 63.99,29.98 v63.82,30.16 | C22.+ 85.55,29.98 v85.42,29.98 | v73.66,30.8 C23.1 72.34,26.88 C21.1 | v105.41,31.75 105.41,26.51 103.66,26.51 103.66,23.18 R33.2 98.58,23.18 97.63,22.23 | v52.07,31.11 51.12,31.11 | 51.12,31.11 50.91,31.11 C18.1 | C16.1 51.12,31.11
  Top 1.27: v25.4,44.45 24.13,43.18 24.13,31.75 24.15,31.59 C50.+ 22.23,30.16 21.91,30.48 | C12.+ 43.95,29.98 45.72,31.75 v45.72,45.72 | C17.+ 65.72,30.16 67.31,31.75 v67.31,45.72 | C22.+ 87.77,29.98 88.9,31.11 v88.9,45.72
  Bottom 0.813: v20.64,30.48 20.64,31.43 v16.83,31.43 v11.29,31.43 v7.62,31.43 | v42.23,29.84 42.23,31.11 v38.1,31.11 v33.34,31.11 v30.16,31.11 | v63.82,30.16 63.82,31.11 60.48,31.11 v60.17,31.43 59.85,31.11 v55.09,31.11 v52.07,31.11 | v85.42,29.98 85.41,31.11 81.5,31.11 v81.18,31.43 80.86,31.11 v76.2,31.11 73.98,31.11 v73.66,30.8
  other vias: 24.13,45.72 24.13,46.99 45.72,46.99 67.31,46.99 88.9,46.99 25.4,46.99 25.4,45.72 44.45,46.99 46.99,45.72 44.45,45.72 44.45,44.45 46.99,46.99 46.99,44.45 66.04,46.99 66.04,45.72 66.04,44.45 68.58,44.45 68.58,45.72 68.58,46.99 87.63,46.99 87.63,45.72 87.63,44.45 90.17,44.45 90.17,45.72 90.17,46.99 107.95,44.45 105.41,44.45 106.68,44.45 107.95,45.72 106.68,45.72 105.41,45.72 105.41,46.99 106.68,46.99 107.95,46.99 120.65,44.45 121.92,44.45 123.19,44.45 123.19,45.72 121.92,45.72 120.65,45.72 120.65,46.99 121.92,46.99 123.19,46.99 138.43,46.99 137.16,45.72 138.43,45.72 138.43,44.45 137.16,44.45 135.89,44.45 137.16,46.99 135.89,46.99 135.89,45.72 105.41,34.29 105.41,33.02 120.65,31.75 120.65,33.02 120.65,34.29 135.89,34.29 135.89,33.02 135.89,31.75 137.16,33.02 137.16,34.29 137.16,31.75 121.92,34.29 121.92,33.02 121.92,31.75 106.68,34.29 106.68,33.02 106.68,31.75
  pour Top (no thermals): 22.86,52.07 22.86,45.72 arc90 25.4,43.18 92.71,43.18 92.71,40.64 93.98,39.37 96.52,39.37 97.79,40.64 97.79,43.18 139.7,43.18 140.97,44.45 140.97,52.07
  pour Bottom (no thermals): 140.97,50.8 22.86,50.8 22.86,44.45 24.13,43.18 92.71,43.18 92.71,40.64 93.98,39.37 96.52,39.37 97.79,40.64 97.79,43.18 104.14,43.18 104.14,30.48 109.22,30.48 109.22,38.1 107.95,39.37 107.95,41.91 109.22,43.18 119.38,43.18 119.38,30.48 124.46,30.48 124.46,38.1 123.19,39.37 123.19,41.91 124.46,43.18 134.62,43.18 134.62,30.48 139.7,30.48 139.7,38.1 138.43,39.37 138.43,41.91 140.97,44.45
  pour Top: 104.14,30.48 109.22,30.48 109.22,36.83 111.76,39.37 111.76,41.91 106.68,41.91 104.14,39.37
  pour Top: 119.38,30.48 124.46,30.48 124.46,36.83 127,39.37 127,41.91 121.92,41.91 119.38,39.37
  pour Top: 134.62,30.48 139.7,30.48 139.7,36.83 142.24,39.37 142.24,41.91 137.16,41.91 134.62,39.37
X-DIR  (via drill 0.51)
  Top 0.254: IC6.24 120.07,19.07 119.86,19.27 118.97,20.16 117,20.16 115.96,19.13 112.92,19.13 v112.6,19.44 | U2.14 16.87,29.48 17.46,29.84 18.41,29.84 20,27.62 20,23.18 24.77,23.18 25.4,22.54 25.4,16.19 26.04,14.92 26.04,2.41 89.46,2.41 v89.58,2.53 | v93.06,11 93.06,11.99 v95.13,14.06
  Bottom 0.254: v89.58,2.53 89.97,2.6 89.97,4.83 89.71,4.93 89.71,8.79 91.92,11 v93.06,11 | v95.13,14.06 95.22,13.97 97.31,13.97 99.09,12.19 103.05,12.19 110.31,19.44 v112.6,19.44
X-STEP  (via drill 0.51, 0.6)
  Top 0.254: v109.5,8.39 v112.16,12.17 | IC6.16 126.57,16.23 126.56,16.23 123.35,13.02 123.35,12.55 v123.42,12.48 | 16.83,22.26 U2.11 16.83,22.3 16.83,20.95 v17.46,19.84 | v24.13,13.34 25.08,13.34 25.08,1.59 87.12,1.59 87.57,1.62 99.98,1.62 v100.64,2.27
  Bottom 0.254: v109.5,8.39 106.1,8.62 105.44,8.3 100.64,3.81 v100.64,2.27 | v24.13,13.34 20.64,13.34 20.64,19.84 v17.46,19.84 | v123.42,12.48 122.45,12.48 121.28,13.18 118.43,13.18 117.79,12.7 112.69,12.7 v112.16,12.17
X-STOP  (via drill 0.51)
  Top 0.254: C5.+ JP9.1 | v129.34,17.83 129.34,18.92 127.18,21.08 125.85,21.08 125.57,21.11 124.78,20.48 124.62,20 123.85,19.23 123.85,19.07 123.77,19.07 IC6.21 | v149.6,22.85 152.93,26.34 152.93,31.83 154.89,33.78 154.89,34.14 C5.+ | R1.2 155.04,34.42 C5.+
  Bottom 0.254: v129.34,17.83 138.12,17.83 143.13,22.85 v149.6,22.85
Y-DIR  (via drill 0.51)
  Top 0.254: v117.04,18.58 117.7,18.77 118.02,18.87 118.84,18.05 118.95,17.96 IC6.26 | v97.77,11.11 97.65,9.68 92.3,5.28 91.29,5.28 90.71,5.21 86.87,5.21 86.74,5.08 67.06,5.08 66.8,5.33 65.28,5.33 65.02,5.08 47.31,5.08 47.31,13.34 43.5,17.14 43.5,22.86 40.96,22.86 40.32,23.5 40.32,29.84 39.69,29.84 38.46,29.48 U1.14
  Bottom 0.254: v97.77,11.11 97.92,10.95 106.04,10.95 107.95,12.7 110.81,12.7 112.08,13.97 112.87,13.97 117.16,18.26 v117.04,18.58
Y-STEP  (via drill 0.51)
  Top 0.254: v91.42,3.96 90.47,4.12 89.99,4.6 89.92,4.7 87.31,4.7 87.19,4.57 66.67,4.57 66.42,4.83 65.66,4.83 65.41,4.57 46.67,4.57 46.67,13.02 42.86,16.83 42.86,18.73 40.32,18.73 39.69,19.37 39.69,20 38.46,21.23 U1.11 | IC6.25 119.53,18.49 120.72,17.3 121.13,17.3 121.65,17.82 v121.69,17.82 | v94.62,4.62 94.63,4.62 99.22,9.21 99.22,13.34 v99.34,13.46
  Bottom 0.254: v121.69,17.82 120.52,17.98 117.17,21.18 111.14,21.18 102.89,13.09 99.71,13.09 v99.34,13.46 | v94.62,4.62 93.9,3.35 91.81,3.32 v91.42,3.96
Y-STOP  (via drill 0.51, 0.51 pad 1.02)
  Top 0.254: C6.+ JP10.1 | R2.2 165.1,34.42 C6.+ | IC6.22 123.22,19.63 123.22,19.71 123.98,20.48 123.98,21.11 v124.32,21.45 | v162.56,34.29 162.6,34.25 C6.+
  Bottom 0.254: v162.56,34.29 162.56,28.37 160.91,26.72 143.96,26.72 139.15,21.91 124.94,21.91 v124.32,21.45
Z-DIR  (via drill 0.51)
  Top 0.254: v90.81,8.62 89.66,6.83 89.66,6.73 85.69,6.73 85.41,6.6 67.82,6.6 67.82,14.41 70.17,16.76 70.17,27.62 62.55,27.62 62.55,29.21 61.91,29.84 60.96,29.84 60.33,29.21 60.33,28.44 U3.14 | IC6.42 119.51,6.88 119.35,6.73 119.28,6.73 116.2,3.65 113.1,3.65 v113.08,3.67
  Bottom 0.254: v90.81,8.62 92.33,9.34 109.83,9.34 109.96,9.21 110.97,9.21 111.6,8.57 111.6,3.65 111.62,3.67 v113.08,3.67
Z-STEP  (via drill 0.51)
  Top 0.254: v92.91,4.43 94.16,3.17 101.6,3.17 102.87,1.91 115.57,1.91 119.88,6.21 119.94,6.21 120.07,6.33 IC6.43 | v91.5,7.26 v91.5,7.27 90.27,6.48 90.02,6.22 86.14,6.22 86.01,6.1 67.56,6.1 66.99,6.67 66.99,14.92 64.77,17.14 64.77,19.05 61.75,19.05 61.44,19.37 61.44,20.95 60.96,20.95 60.38,21.37 60.38,22.29 U3.11
  Bottom 0.254: v91.5,7.26 91.5,6.93 93.03,5.4 93.03,4.55 v92.91,4.43
Z-STOP  (via drill 0.51, 0.51 pad 1.02)
  Top 0.254: C7.+ JP11.1 | R3.2 175.26,34.42 C7.+ | IC6.23 120.91,19.89 122.56,21.54 v123.09,22.55 | v171.96,34.29 175.22,34.29 C7.+
  Bottom 0.254: v123.09,22.55 138.42,22.55 143.47,27.45 159.68,27.45 161.54,29.46 161.54,34.8 162.31,35.56 170.69,35.56 v171.96,34.29

## Text on the board
Reference: power | X motor | Y motor | E motor | bed | hot end | fan | Z motor | + | - | x-stop | y-stop | z-stop | btemp | etemp | AUTO-RESET | VREG | Micro SD | A4 | USB | USB | ISP | Vcc | RX1 | TX1 | SCL | SDA | !RESET | SCLK | MISO | Made in the UK | RESET | reprappro.com RepRap Melzi V2.0 Licence: GPL Design: Joe Mosfet & Adrian | GND | A4 | A3 | A2 | A1 | GND | MOSI | Vcc
_tsilk: POWER | HOTBED | HOTEND | FAN | X-MOTOR | Y-MOTOR | Z-MOTOR | E-MOTOR | XSTOP | YSTOP | ZSTOP | BTEMP | ETEMP | 12-30V | GND | PWR | GND | PWR | GND | PWR | GND | http://reprap.org/wiki/Melzi | C2 | C3 | C4 | S3 | S4 | S5 | S6 | S7 | S8 | R1 | R2 | R3 | R4 | R5 | C5 | C6 | C7 | C8 | C9 | C15 | C16 | C19 | C20 | C23 | C24 | T2 | T3 | T4 | LM7805 VREG | C26 | C28 | M1 | C29 | M2 | C30 | M3 | C27 | R10 | R11 | R12 | C32 | C31 | C14 | C18 | C22 | A4988 | A4988 | A4988 | A4988 | A4988 | BYPASS | BYPASS | BYPASS | C17 | R7 | C21 | R8 | C25 | R9 | STATUS | C35 | R18 | C37 | R21 | C39 | R24 | AUTO-RESET | C36 | R17 | C38 | R20 | C40 | R23 | 4050D | VREG | L1 | R25 | C41 | C42 | C43 | FTDI FT232RL | R16 | F19 | R22 | C44 | C45 | USB | PWR-SEL | ATMEGA644 | MS1 | MS2 | MS3 | MS1 | MS2 | MS3 | MS1 | MS2 | MS3 | Q1 16MHz | D10 | D11 | D16 | D17 | Melzi Ardentissimo | Based on Sanguinololu | 5V | RX1 | TX1 | SCL | SDA | RESET | SCK | MISO | R26 | Designed for | RepRapPro.com | USB | EXT | ISP | RESET | MICRO-SD | GND | A4 | A3 | A2 | A1 | GND | MOSI | 5V